# Altium project ThrusterBoard.PrjPcb
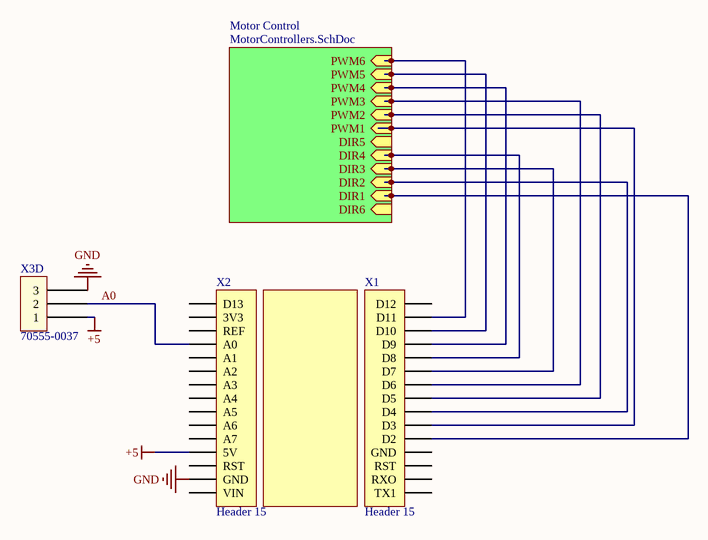
[diagram p0: Thruster Board.SchDoc]
5 sheets, 54 parts. Net scope: hierarchical (ports join the sheet entries above them; power ports are global).
Board files: ThrusterBoard.PcbDoc, ThrusterBoardOld.PcbDoc
Sheets:
  Thruster Board.SchDoc
    Motor Control = MotorControllers.SchDoc
      M1 = HBridges.SchDoc
      M2 = HBridges.SchDoc
      M3 = HBridges.SchDoc
      M4 = HBridges.SchDoc
      M5 = ESC.SchDoc
      M6 = ESC.SchDoc
  TB Microcontroller.SchDoc

## Sheet Thruster Board.SchDoc
size A; Organization: Underwater Robotics; Address1: c/o Student Involvement; Address2: Campus Box 7306; Address3: 2016 Cates Ave. Raleigh, NC 27695; Revision: A1; SheetNumber: 1F; SheetTotal: 5F

### Parts
X1  Header 15  [HDR1X15]
X2  Header 15  [HDR1X15]
X3D  70555-0037  [70555-0037]

### Sub-sheets
Motor Control = MotorControllers.SchDoc: PWM1 (in), PWM2 (in), PWM3 (in), PWM4 (in), PWM5 (in), DIR1 (in), DIR2 (in), DIR3 (in), DIR4 (in), DIR5 (in), DIR6 (in), PWM6 (in)

### Nets
+5: X2.12(5V) X3D.1
GND: X2.14(GND) X3D.3
A0: X2.?1(A0) X3D.2
DIR1: X1.5(D2) ; sheet Motor Control/DIR1
DIR2: X1.7(D4) ; sheet Motor Control/DIR2
DIR3: X1.10(D7) ; sheet Motor Control/DIR3
DIR4: X1.11(D8) ; sheet Motor Control/DIR4
PWM1: X1.6(D3) ; sheet Motor Control/PWM1
PWM2: X1.8(D5) ; sheet Motor Control/PWM2
PWM3: X1.9(D6) ; sheet Motor Control/PWM3
PWM4: X1.12(D9) ; sheet Motor Control/PWM4
PWM5: X1.13(D10) ; sheet Motor Control/PWM5
PWM6: X1.14(D11) ; sheet Motor Control/PWM6

Not connected (* = marked no-connect by the designer): X1 1(TX1) 2(RXO) 3(RST) 4(GND) 15(D12); X2 1(D13) 2(3V3) 3(REF) 5(A1) 6(A2) 7(A3) 8(A4) 9(A5) 10(A6) 11(A7) 13(RST) 15(VIN)

### Notes on the sheet
- Title
- Size:
- Date:
- A
- Number:
- Time:
- Revision:
- Sheet
- of
- File:

### Library data of the parts
X1 X2 = Header 15: Header, 15-Pin; LatestRevisionDate: 17-Jul-2002; LatestRevisionNote: Re-released for DXP Platform.; Publisher: Altium Limited
X3D = 70555-0037: Molex, C-Grid SL 70555, 3 Pin; Product Range: SL 70555 Series; Contact Termination Type: Through Hole; Gender: Header; No. of Contacts: 3; Pitch Spacing: 2.54; No. of Rows: 1; Supplier 1: Newark; Supplier Part Number 1: 59H2958; Manufacturer: MOLEX; RoHS: YES; Stock 1: 1580; Pricing 1: 1=0.679, 10=0.622, 100=0.575, 500=0.575, 1000=0.534, 2000=0.495, 5000=0.484, 10000=0.47 (USD); Contact Plating: Gold Plated Contacts; ComponentLink1URL: http://www.farnell.com/cad/1737917.pdf; ComponentLink1Description: http://www.farnell.com/cad/1737917.pdf; ComponentLink2URL: http://www.farnell.com/datasheets/1947503.pdf; ComponentLink2Description: http://www.farnell.com/datasheets/1947503.pdf; ComponentLink3URL: http://www.farnell.com/cad/1980011.zip; ComponentLink3Description: http://www.farnell.com/cad/1980011.zip

## Sheet MotorControllers.SchDoc
size A; Organization: Underwater Robotics; Address1: c/o Student Involvement; Address2: Campus Box 7306; Address3: 2016 Cates Ave. Raleigh, NC 27695; SheetNumber: 2E; SheetTotal: 5E
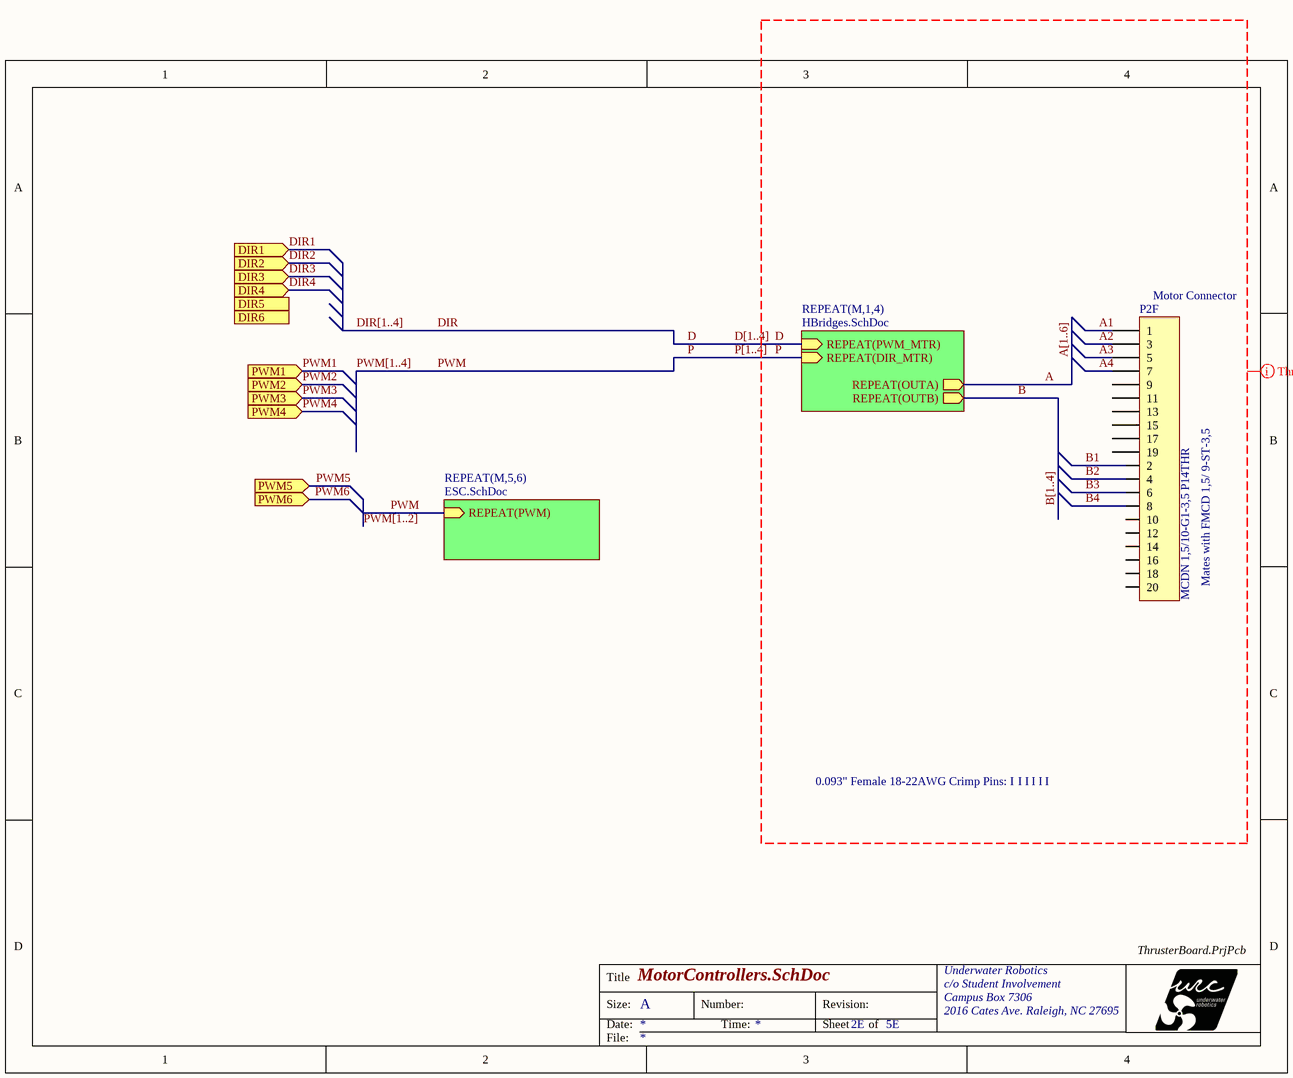
[diagram p1: MotorControllers.SchDoc]

### Parts
i2F  FMCD 1,5/ 9-ST-3,5 (placeholder)  (value not drawn)
i4F  0.093" Crimp Pin, Female (Placeholder)  (value not drawn)
i5F  0.093" Crimp Pin, Female (Placeholder)  (value not drawn)
i6F  0.093" Crimp Pin, Female (Placeholder)  (value not drawn)
i7F  0.093" Crimp Pin, Female (Placeholder)  (value not drawn)
i8F  0.093" Crimp Pin, Female (Placeholder)  (value not drawn)
i9F  0.093" Crimp Pin, Female (Placeholder)  (value not drawn)
P2F  MCDN 1,5/10-G1-3,5 P14THR  [MCDN 1,5/10-G1-3,5 P14THR w/ FMCD 1,5 9-ST-3,5]

### Sub-sheets
REPEAT(M,1,4) = HBridges.SchDoc: REPEAT(OUTA) (out), REPEAT(OUTB) (out), REPEAT(PWM_MTR) (in), REPEAT(DIR_MTR) (in)
REPEAT(M,5,6) = ESC.SchDoc: REPEAT(PWM) (in)

### Ports
DIR1 (in), DIR2 (in), DIR3 (in), DIR4 (in), DIR5 (in), DIR6 (in), PWM1 (in), PWM2 (in), PWM3 (in), PWM4 (in), PWM5 (in), PWM6 (in)

### Nets
A: sheet REPEAT(M,1,4)/REPEAT(OUTA)
A1: P2F.1
A2: P2F.3
A3: P2F.5
A4: P2F.7
B: sheet REPEAT(M,1,4)/REPEAT(OUTB)
B1: P2F.2
B2: P2F.4
B3: P2F.6
B4: P2F.8
D: sheet REPEAT(M,1,4)/REPEAT(PWM_MTR)  [also labelled DIR]
P: sheet REPEAT(M,1,4)/REPEAT(DIR_MTR), sheet REPEAT(M,5,6)/REPEAT(PWM)  [also labelled PWM]

Not connected (* = marked no-connect by the designer): P2F 9 10 11 12 13 14 15 16 17 18 19 20

### Buses and harness runs
bus A[1..6]
bus B[1..4]
bus D[1..4]
bus DIR[1..4]
bus P[1..4]
bus PWM[1..2]
bus PWM[1..4]

### Layout directives
net class ThrusterPower: A, A1, A2, A3, A4, A[1..6], B, B1, B2, B3, B4, B[1..4], D, P

### Notes on the sheet
- (near P2F) Motor Connector
- Title
- Size:
- Date:
- A
- Number:
- Time:
- Revision:
- Sheet
- of
- File:
- (in symbol 0.093" Crimp Pin, Female (Placeholder)) 0.093" Female 18-22AWG Crimp Pins: I; I
- (in symbol FMCD 1,5/ 9-ST-3,5 (placeholder)) Mates with FMCD 1,5/ 9-ST-3,5

### Library data of the parts
i2F = FMCD 1,5/ 9-ST-3,5 (placeholder): Manufacturer 1: Phoenix Contact; Manufacturer Part Number: 1738872; Description 1: Pluggable Terminal Blocks 9 Pos 3.5mm pitch Plug 24-16AWG Spring; Connection Method: Spring Cage; Current Rating: 8 A; Number of Positions: 9 Position; Voltage Rating: 160 V; Pitch: 3.5 mm; Wire Gauge Range: 24-16; Supplier 1: Mouser; Supplier Part Number 1: 651-1738872; RoHS: RoHS Compliant; Category: Pluggable Terminal Blocks; Stock 1: 18; Pricing 1: 1=29.42, 10=28.62, 25=27.89, 50=26.75, 100=24.61, 250=22.74, 500=21.66 (AUD); Contact Plating: Tin; Packaging: Bulk; Product: Plugs; Series: FMCD; Termination Style: -; Brand: Phoenix Contact; Product Category: Pluggable Mini Terminal Blocks; Standard Pack Qty: 50; Tradename: COMBICON Control; RoHS - Mouser: Y; Minimum Order Quantity: 1; Reeling: False; ComponentLink1URL: http://www.phoenixcontact.com/us/products/1738872/pdf; ComponentLink1Description: http://www.phoenixcontact.com/us/products/1738872/pdf
i4F i5F i6F i7F i8F i9F = 0.093" Crimp Pin, Female (Placeholder): Standard female crimp pin for 0.093" Molex Connector Series; Description 1: MOLEX - 02-09-1119 - CONTACT, SOCKET, 22-18AWG, CRIMP; Product Range: Standard .093; Wire Size AWG Min: 22; Wire Size AWG Max: 18; Connector Type: Contact, Crimp; Supplier 1: Newark; Supplier Part Number 1: 06H1959; Manufacturer 1: MOLEX; RoHS: YES; Stock 1: 54700; Pricing 1: 1=0.17, 100=0.134, 500=0.109, 1000=0.087, 2000=0.072, 5000=0.062, 10000=0.053 (USD); Contact Gender: Socket; Contact Termination Type: Crimp; Contact Material: Brass; ComponentLink1URL: http://www.farnell.com/cad/1834595.pdf; ComponentLink1Description: http://www.farnell.com/cad/1834595.pdf; ComponentLink2URL: http://www.farnell.com/datasheets/2000530.pdf; ComponentLink2Description: http://www.farnell.com/datasheets/2000530.pdf; Manufacturer Part Number: 02-09-1119
P2F = MCDN 1,5/10-G1-3,5 P14THR: Header, 20-Pin

## Sheet HBridges.SchDoc
size A; Organization: Underwater Robotics; Address1: c/o Student Involvement; Address2: Campus Box 7306; Address3: 2016 Cates Ave. Raleigh, NC 27695; Revision: A1; SheetNumber: 4F; SheetTotal: 5F
Used 4 times, as channels Motor Control/M1, Motor Control/M2, Motor Control/M3, Motor Control/M4. Parts and nets are listed once, with the designators drawn on the sheet.
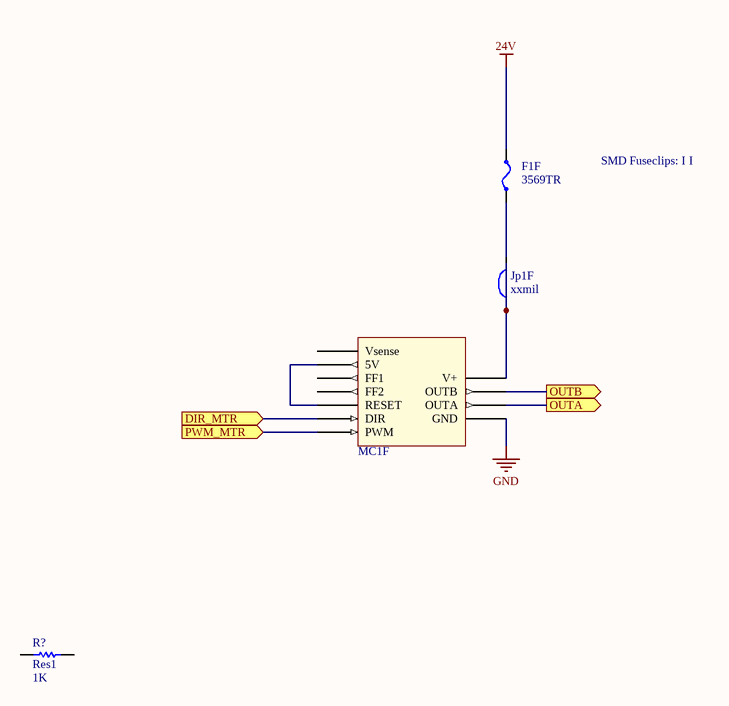
[diagram p2: HBridges.SchDoc]

### Parts
F1F  3569TR  [Horizontal SMD fuse clip]
i10F  3569TR (Placeholder)  (value not drawn)
i11F  3569TR (Placeholder)  (value not drawn)
Jp1F  value xxmil  [Jumper, 12AWG, 0.6"]  (hidden comment: Jumper)
MC1F  Motor Controller  [Pololu 24v12]  (value not drawn)
R?  Res1  value 1K  [AXIAL-0.3]

### Ports
DIR_MTR (in), OUTA (out), OUTB (out), PWM_MTR (in)

### Nets
24V: F1F.1
GND: MC1F.GND
DIR_MTR: MC1F.DIR ; port DIR_MTR
OUTA: MC1F.OUTA ; port OUTA
OUTB: MC1F.OUTB ; port OUTB
PWM_MTR: MC1F.PWM ; port PWM_MTR
NetF1F_2: F1F.2 Jp1F.2
NetJp1F_1: Jp1F.1 MC1F.V+
NetMC1F_5V: MC1F.5V MC1F.RESET

Not connected (* = marked no-connect by the designer): MC1F FF1 FF2 V+_SENSE(Vsense); R? 1 2

### Channels
Motor Control/M1: designators end in _M1; ports DIR_MTR=P1 OUTA=A1 OUTB=B1 PWM_MTR=D1
Motor Control/M2: designators end in _M2; ports DIR_MTR=P2 OUTA=A2 OUTB=B2 PWM_MTR=D2
Motor Control/M3: designators end in _M3; ports DIR_MTR=P3 OUTA=A3 OUTB=B3 PWM_MTR=D3
Motor Control/M4: designators end in _M4; ports DIR_MTR=P4 OUTA=A4 OUTB=B4 PWM_MTR=D4

### Notes on the sheet
- Title
- Size:
- Date:
- A
- Number:
- Time:
- Revision:
- Sheet
- of
- File:
- (in symbol 3569TR (Placeholder)) SMD Fuseclips: I; I

### Library data of the parts
F1F = 3569TR: Fuse Clip Assembly; Manufacturer 1: KEYSTONE; Subassembly: Yes; Description 1: KEYSTONE - 3569TR - FUSE CLIP, AUTO BLADE, SMT; Supplier 1: Newark; Supplier Part Number 1: 24T5056; RoHS: YES; Stock 1: 1000; Pricing 1: 1=0.798, 50=0.672, 100=0.644, 250=0.589, 500=0.566, 1000=0.491, 2500=0.427, 5000=0.413 (USD); ComponentLink1URL: http://www.farnell.com/datasheets/1703973.pdf; ComponentLink1Description: http://www.farnell.com/datasheets/1703973.pdf; Manufacturer Part Number: 3569TR
i10F i11F = 3569TR (Placeholder): Fuse Clip; Manufacturer 1: KEYSTONE; Subassembly: Yes; Description 1: KEYSTONE - 3569TR - FUSE CLIP, AUTO BLADE, SMT; Supplier 1: Newark; Supplier Part Number 1: 24T5056; RoHS: YES; Stock 1: 1000; Pricing 1: 1=0.798, 50=0.672, 100=0.644, 250=0.589, 500=0.566, 1000=0.491, 2500=0.427, 5000=0.413 (USD); ComponentLink1URL: http://www.farnell.com/datasheets/1703973.pdf; ComponentLink1Description: http://www.farnell.com/datasheets/1703973.pdf; Manufacturer Part Number: 3569TR
Jp1F = Jump: Resistor
MC1F = Pololu 24v12: Pololu 24v12 Motor Driver; Supplier 1: Pololu; Supplier Part Number 1: 24v12
R? = Res1: Resistor; Published: 8-Jun-2000; LatestRevisionDate: 17-Jul-2002; LatestRevisionNote: Re-released for DXP Platform.; PackageReference: AXIAL-0.3; Publisher: Altium Limited; PackageDescription: Axial Device, Thru-Hole; 2 Leads; 0.3 in Pin Spacing

## Sheet ESC.SchDoc
size A
Used 2 times, as channels Motor Control/M5, Motor Control/M6. Parts and nets are listed once, with the designators drawn on the sheet.
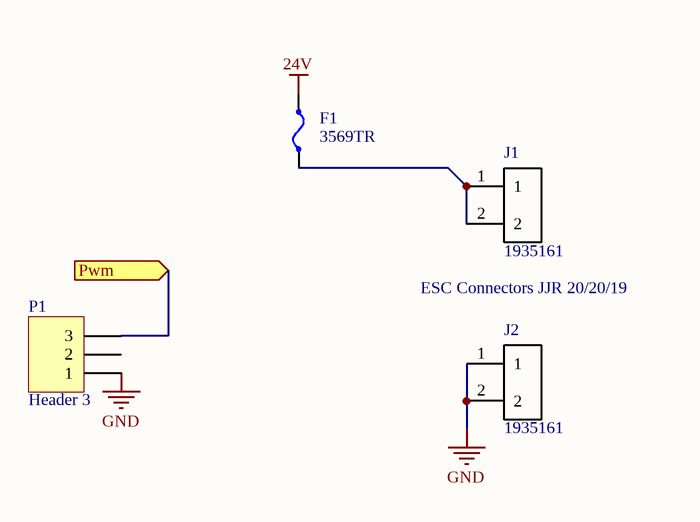
[diagram p3: ESC.SchDoc]

### Parts
F1  3569TR  [Horizontal SMD fuse clip]
J1  1935161  [PHOENIX_1935161]
J2  1935161  [PHOENIX_1935161]
P1  Header 3  [HDR1X3]

### Ports
Pwm (in)

### Nets
24V: F1.1
GND: J2.1 J2.2 P1.1
Pwm: P1.3 ; port Pwm
NetF1_2: F1.2 J1.1 J1.2

Not connected (* = marked no-connect by the designer): P1 2

### Channels
Motor Control/M5: designators end in _M1; ports Pwm=PWM5
Motor Control/M6: designators end in _M2; ports Pwm=PWM6

### Notes on the sheet
- ESC Connectors JJR 20/20/19

### Library data of the parts
F1 = 3569TR: as F1F on sheet HBridges; Supplier 1: Newark; Supplier Part Number 1: 24T5056; RoHS: YES; Stock 1: 1000; Pricing 1: 1=0.798, 50=0.672, 100=0.644, 250=0.589, 500=0.566, 1000=0.491, 2500=0.427, 5000=0.413 (USD); ComponentLink1URL: http://www.farnell.com/datasheets/1703973.pdf; ComponentLink1Description: http://www.farnell.com/datasheets/1703973.pdf; Manufacturer Part Number: 3569TR
J1 J2 = 1935161: Conn Terminal Blocks 2 POS 5mm Solder ST Thru-Hole 16A; MF: Phoenix Contact; Package: None; MP: 1935161; SnapEDA_Link: https://www.snapeda.com/parts/1935161/Phoenix%20Contact/view-part/?ref=snap; Availability: Unavailable; Price: None; Value: *
P1 = Header 3: Header, 3-Pin; LatestRevisionDate: 17-Jul-2002; LatestRevisionNote: Re-released for DXP Platform.; Publisher: Altium Limited

## Sheet TB Microcontroller.SchDoc
size A; Organization: Underwater Robotics; Address1: c/o Student Involvement; Address2: Campus Box 7306; Address3: 2016 Cates Ave. Raleigh, NC 27695; Revision: A1; SheetNumber: 5F; SheetTotal: 5F
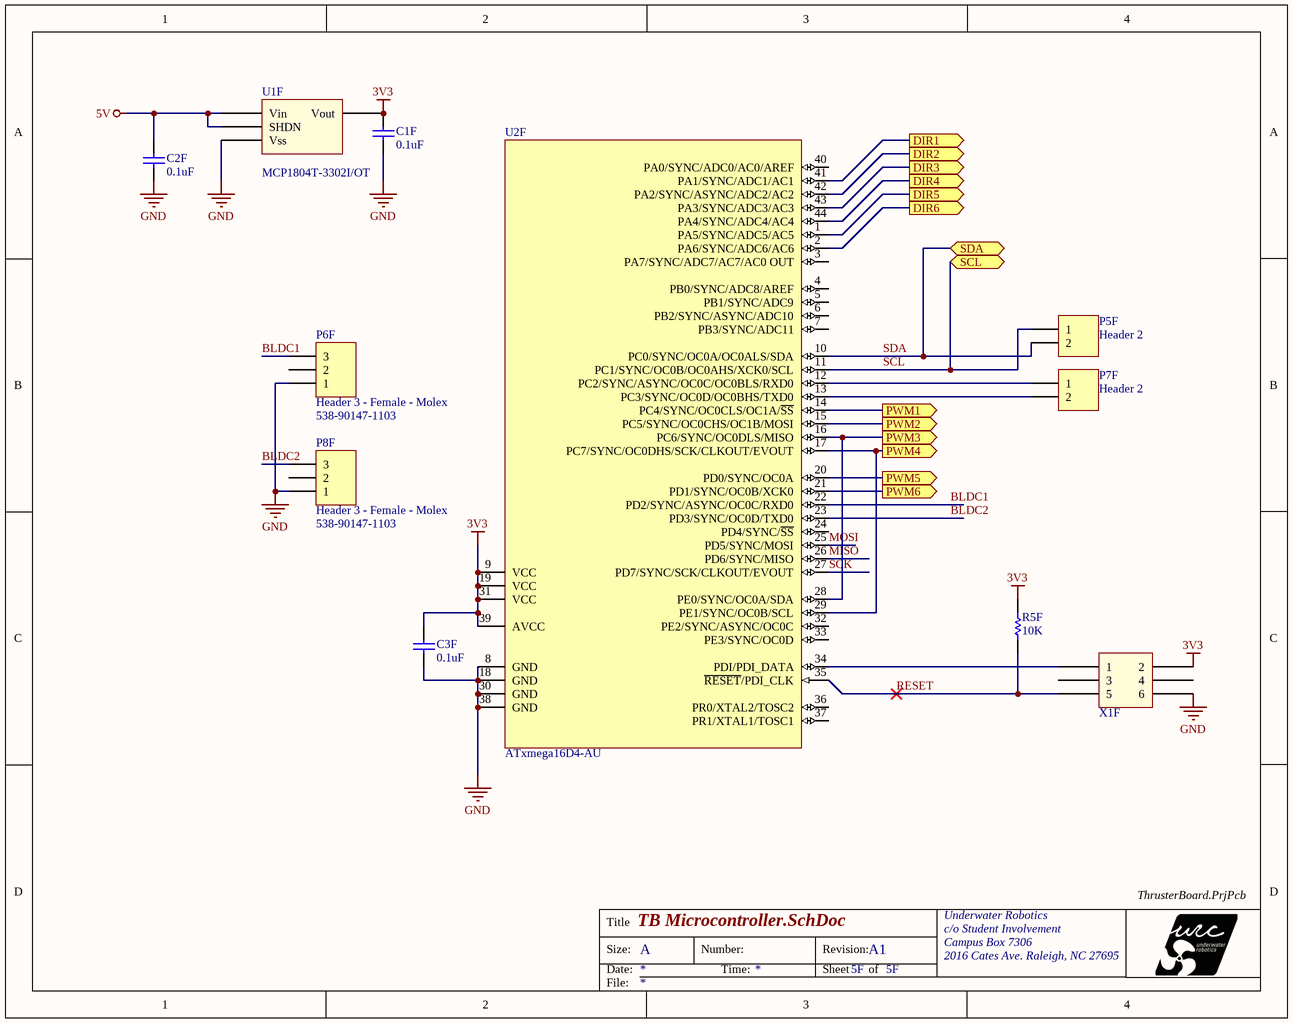
[diagram p4: TB Microcontroller.SchDoc]

### Parts
C1F  value 0.1uF  [C0603]  (hidden comment: 0.1uF, C0603, MultiComp)
C2F  value 0.1uF  [C0603]  (hidden comment: 0.1uF, C0603, MultiComp)
C3F  value 0.1uF  [C0603]  (hidden comment: 0.1uF, C0603, MultiComp)
P5F  Header 2  [HDR1X2]
P6F  Header 3 - Female - Molex  Supplier Part Number 1: 538-90147-1103  [HDR1X3 - Female - Molex]
P7F  Header 2  [HDR1X2]
P8F  Header 3 - Female - Molex  Supplier Part Number 1: 538-90147-1103  [HDR1X3 - Female - Molex]
R5F  value 10K  [R0603]  (hidden comment: Resistor)
U1F  MCP1804T-3302I/OT  [MCP1804T-3302I/OT]
U2F  ATxmega16D4-AU  [44A_N]
X1F  Header  [2x3 Header]  (value not drawn)

### Ports
DIR1 (out), DIR2 (out), DIR3 (out), DIR4 (out), DIR5 (out), DIR6 (out), PWM1 (out), PWM2 (out), PWM3 (out), PWM4 (out), PWM5 (out), PWM6 (out), SCL (bidir), SDA (bidir)

### Nets
3V3: C1F.1(+) C3F.1(+) R5F.2 U1F.Vout U2F.9(VCC) U2F.19(VCC) U2F.31(VCC) U2F.39(AVCC) X1F.2
5V: C2F.1(+) U1F.SHDN U1F.Vin
GND: C1F.2 C2F.2 C3F.2 P6F.1 P8F.1 U1F.Vss U2F.8(GND) U2F.18(GND) U2F.30(GND) U2F.38(GND) X1F.6
BLDC1: P6F.3 U2F.22(PD2/SYNC/ASYNC/OC0C/RXD0)
BLDC2: P8F.3 U2F.23(PD3/SYNC/OC0D/TXD0)
MISO: U2F.26(PD6/SYNC/MISO)
MOSI: U2F.25(PD5/SYNC/MOSI)
RESET: R5F.1 U2F.35(~{RESET}/PDI_CLK) X1F.5
SCK: U2F.27(PD7/SYNC/SCK/CLKOUT/EVOUT)
SCL: P5F.1 U2F.11(PC1/SYNC/OC0B/OC0AHS/XCK0/SCL) ; port SCL
SDA: P5F.2 U2F.10(PC0/SYNC/OC0A/OC0ALS/SDA) ; port SDA
NetP7F_1: P7F.1 U2F.12(PC2/SYNC/ASYNC/OC0C/OC0BLS/RXD0)
NetP7F_2: P7F.2 U2F.13(PC3/SYNC/OC0D/OC0BHS/TXD0)
NetU2F_1: U2F.1(PA5/SYNC/ADC5/AC5) ; port DIR5
NetU2F_2: U2F.2(PA6/SYNC/ADC6/AC6) ; port DIR6
NetU2F_14: U2F.14(PC4/SYNC/OC0CLS/OC1A/~{SS}) ; port PWM1
NetU2F_15: U2F.15(PC5/SYNC/OC0CHS/OC1B/MOSI) ; port PWM2
NetU2F_16: U2F.16(PC6/SYNC/OC0DLS/MISO) U2F.28(PE0/SYNC/OC0A/SDA) ; port PWM3
NetU2F_17: U2F.17(PC7/SYNC/OC0DHS/SCK/CLKOUT/EVOUT) U2F.29(PE1/SYNC/OC0B/SCL) ; port PWM4
NetU2F_20: U2F.20(PD0/SYNC/OC0A) ; port PWM5
NetU2F_21: U2F.21(PD1/SYNC/OC0B/XCK0) ; port PWM6
NetU2F_34: U2F.34(PDI/PDI_DATA) X1F.1
NetU2F_41: U2F.41(PA1/SYNC/ADC1/AC1) ; port DIR1
NetU2F_42: U2F.42(PA2/SYNC/ASYNC/ADC2/AC2) ; port DIR2
NetU2F_43: U2F.43(PA3/SYNC/ADC3/AC3) ; port DIR3
NetU2F_44: U2F.44(PA4/SYNC/ADC4/AC4) ; port DIR4

Not connected (* = marked no-connect by the designer): P6F 2; P8F 2; U2F 3(PA7/SYNC/ADC7/AC7/AC0_OUT) 4(PB0/SYNC/ADC8/AREF) 5(PB1/SYNC/ADC9) 6(PB2/SYNC/ASYNC/ADC10) 7(PB3/SYNC/ADC11) 24(PD4/SYNC/~{SS}) 32(PE2/SYNC/ASYNC/OC0C) 33(PE3/SYNC/OC0D) 36(PR0/XTAL2/TOSC2) 37(PR1/XTAL1/TOSC1) 40(PA0/SYNC/ADC0/AC0/AREF); X1F 3 4

### Notes on the sheet
- Title
- Size:
- Date:
- A
- Number:
- Time:
- Revision:
- Sheet
- of
- File:

### Library data of the parts
C1F C2F C3F = 0.1uF, C0603, MultiComp: Ceramic MLCC, Multicompo, X7R Dielectric; Manufacturer Part Number: MC0603B104K500CT; Description 1: MULTICOMP - MC0603B104K500CT - CERAMIC CAPACITOR, 0.1UF, 50V, X7R, 10%, 0603; Product Range: MC Series; Capacitance: 0.1 F; Capacitance Tolerance: 10%; Dielectric Characteristic: X7; Voltage Rating: 50; Ceramic Capacitor Case: 0603 [1608 Metric]; Supplier 1: Newark; Supplier Part Number 1: 06R4927; Manufacturer 1: MULTICOMP; RoHS: YES; Stock 1: 166516; Pricing 1: 1=0.075, 10=0.048, 50=0.027, 100=0.021, 250=0.017, 500=0.015, 1000=0.012 (USD); Packaging: Cut Tape; ComponentLink1URL: http://www.farnell.com/datasheets/1522998.pdf; ComponentLink1Description: http://www.farnell.com/datasheets/1522998.pdf; ComponentLink2URL: /pdfs/datasheets/spc/Ta-1098.pdf; ComponentLink2Description: /pdfs/datasheets/spc/Ta-1098.pdf
P5F P7F = Header 2: Header, 2-Pin; LatestRevisionDate: 17-Jul-2002; LatestRevisionNote: Re-released for DXP Platform.; Publisher: Altium Limited
P6F P8F = Header 3 - Female - Molex: Header, 3-Pin; Manufacturer Part Number: 90147-1103; Current Rating: 3 A; Mounting Angle: Vertical; Number of Positions: 3 Position; Voltage Rating: 350 V; Pitch: 2.54 mm; Supplier 1: Mouser; Manufacturer: Molex; RoHS: RoHS Compliant; Category: Headers & Wire Housings; Stock 1: 5207; Pricing 1: 1=1.26, 100=1.09, 500=0.988, 1000=0.895, 2000=0.734, 5000=0.575, 10000=0.490 (AUD); Accessory Type: -; Contact Plating: Tin; Contact Type: -; Housing Material: Polyester; Number of Rows: 1 Row; Packaging: Tube; Product: Headers; Series: 90147; Termination Style: Through Hole; Type: Socket; Brand: Molex; Contact Material: Phosphor Bronze; Mounting Style: Through Hole; Row Spacing: -; Contact Gender: Socket (Female); Housing Gender: -; Product Category: C-Grid Connectors; Standard Pack Qty: 5760; Tradename: C-Grid; RoHS - Mouser: Y; Minimum Order Quantity: 1; Reeling: False; ComponentLink1URL: http://www.mouser.com/ds/2/276/0901471103_PCB_RECEPTACLES-176816.pdf; ComponentLink1Description: http://www.mouser.com/ds/2/276/0901471103_PCB_RECEPTACLES-176816.pdf
R5F = 10k, 1%, 100mW, Yageo, R0603: Manufacturer 1: YAGEO; Manufacturer Part Number: RC0603FR-1010KL; Tolerance: 1%; Description 1: YAGEO - RC0603FR-1010KL - RES, THICK FILM, 10K, 1%, 0.1W, 0603; Product Range: RC Series; Resistance: 10; Power Rating: 100; Voltage Rating: 50; Resistor Case Style: 0603 [1608 Metric]; Body Length: 1.6; Supplier 1: Newark; Supplier Part Number 1: 68R0120; RoHS: YESX; Stock 1: 7839; Pricing 1: 1=0.002, 10=0.002, 25=0.002, 100=0.002, 250=0.002, 1000=0.002 (USD); Resistance Tolerance: 1%; Packaging: Cut Tape; MSL: -; ComponentLink1URL: http://www.farnell.com/datasheets/1868787.pdf; ComponentLink1Description: http://www.farnell.com/datasheets/1868787.pdf; ComponentLink2URL: http://www.yageo.com/pdf/PYu-RC0603_51_RoHS_L_4.pdf; ComponentLink2Description: http://www.yageo.com/pdf/PYu-RC0603_51_RoHS_L_4.pdf
U1F = MCP1804T-3302I/OT: 3.3V Linear Regulator; Manufacturer 1: MICROCHIP; Description 1: MICROCHIP - MCP1804T-3302I/OT - LDO VOLTAGE REGULATOR, 3.3V, 150mA, 5-SOT-23; Input Voltage Min: 2; Input Voltage Max: 28; Output Current: 150; Dropout Voltage Vdo: 260; LDO Regulator Case Style: SOT-23; No. of Pins: 5; URL: http://www.newark.com/microchip/mcp1804t-3302i-ot/ldo-voltage-regulator-3-3v-150ma/dp/55R1047; Supplier 1: Newark; Supplier Part Number 1: 55R1047; RoHS: YES; Stock 1: 12; Pricing 1: 1=0.67, 26=0.56, 100=0.51 (USD); Operating Temperature Min: -40 C; ComponentLink1URL: http://www.farnell.com/datasheets/1789199.pdf; ComponentLink1Description: http://www.farnell.com/datasheets/1789199.pdf; ComponentLink2URL: http://www.farnell.com/cad/1790647.zip; ComponentLink2Description: http://www.farnell.com/cad/1790647.zip; Manufacturer Part Number: MCP1804T-3302I/OT
U2F = ATxmega16D4-AU: 8/16-bit AVR XMEGA D4 Microcontroller, 1.6-3.6V, 32MHz, 16KB + 4KB Flash, 1KB EEPROM, 2KB SRAM, 44-pin TQFP, Industrial Grade (-40°C to 85°C), Pb-Free; Manufacturer 1: ATMEL; Description 1: ATMEL - ATXMEGA16D4-AU - MICROCONTROLLER MCU, 8 BIT, AVR XMEGA, 32MHZ, TQFP-44; CPU Speed: 32; Program Memory Size: 16; RAM Memory Size: 2; No. of Pins: 44; No. of I/O's: 34; Supply Voltage Min: 1.6; DatasheetVersion: revJ, Dec-2010; PackageVersion: revC, Oct-2010; PackageReference: 44A; PackageDescription: 44-Pin Plastic Thin Profile Quad Flat Pack, 10 x 10 x 1.0 mm Body, 0.8 mm Pitch (TQFP); Code_JEDEC: MS-026-ACB; ComponentLink1Description: Manufacturer URL; ComponentLink1URL: http://www.atmel.com/; ComponentLink2Description: ATxmega128D4/64D4/32D4/16D4 Datasheet; ComponentLink2URL: http://www.atmel.com/dyn/resources/prod_documents/doc8135.pdf; Supplier 1: Newark; Supplier Part Number 1: 68T3906; Manufacturer Part Number: ATXMEGA16D4-AU; RoHS: YES; Stock 1: 196; Pricing 1: 1=2.71, 10=2.38, 25=2.24, 50=1.9, 100=1.79, 250=1.72, 500=1.69, 1000=1.49 (USD); Controller Family/Series: ATxmega; MCU Case Style: TQFP; ComponentLink3URL: http://www.farnell.com/datasheets/1693882.pdf; ComponentLink3Description: http://www.farnell.com/datasheets/1693882.pdf; ComponentLink4URL: http://www.farnell.com/cad/1773743.zip; ComponentLink4Description: http://www.farnell.com/cad/1773743.zip; ComponentLink5URL: http://bcove.me/gu8hm7kh; ComponentLink5Description: http://bcove.me/gu8hm7kh
X1F = 2x3 Header: Manufacturer 1: FCI; Manufacturer Part Number: 67996-406HLF; Description 1: FCI - 67996-406HLF - BOARD-BOARD CONNECTOR HEADER, 6 POSITION, 2ROW; Product Range: BergStik 67996 Series; Contact Termination Type: Through Hole; No. of Contacts: 6; Pitch Spacing: 2.54; No. of Rows: 2; Supplier Part Number 1: 20M2191; Supplier 1: Newark; RoHS: YES; Stock 1: 441; Pricing 1: 1=0.254, 10=0.218, 25=0.186, 50=0.178, 100=0.16, 250=0.153, 500=0.128, 1000=0.117 (USD); Gender: Header; Contact Plating: Tin Plated Contacts; ComponentLink1URL: http://www.farnell.com/datasheets/1876884.pdf; ComponentLink1Description: http://www.farnell.com/datasheets/1876884.pdf

## Nets that join several sheets
24V: Motor Control/M1 (F1F_M1.1), Motor Control/M2 (F1F_M2.1), Motor Control/M3 (F1F_M3.1), Motor Control/M4 (F1F_M4.1), Motor Control/M5 (F1_M1.1), Motor Control/M6 (F1_M2.1)
GND: Thruster Board (X2.14 X3D.3), Motor Control/M1 (MC1F_M1.GND), Motor Control/M2 (MC1F_M2.GND), Motor Control/M3 (MC1F_M3.GND), Motor Control/M4 (MC1F_M4.GND), Motor Control/M5 (J2_M1.1 J2_M1.2 P1_M1.1), Motor Control/M6 (J2_M2.1 J2_M2.2 P1_M2.1), TB Microcontroller (11 pins)
A1: MotorControllers (P2F.1), Motor Control/M1 (MC1F_M1.OUTA)
A2: MotorControllers (P2F.3), Motor Control/M2 (MC1F_M2.OUTA)
A3: MotorControllers (P2F.5), Motor Control/M3 (MC1F_M3.OUTA)
A4: MotorControllers (P2F.7), Motor Control/M4 (MC1F_M4.OUTA)
B1: MotorControllers (P2F.2), Motor Control/M1 (MC1F_M1.OUTB)
B2: MotorControllers (P2F.4), Motor Control/M2 (MC1F_M2.OUTB)
B3: MotorControllers (P2F.6), Motor Control/M3 (MC1F_M3.OUTB)
B4: MotorControllers (P2F.8), Motor Control/M4 (MC1F_M4.OUTB)
PWM5: Thruster Board (X1.13), Motor Control/M5 (P1_M1.3)
PWM6: Thruster Board (X1.14), Motor Control/M6 (P1_M2.3)